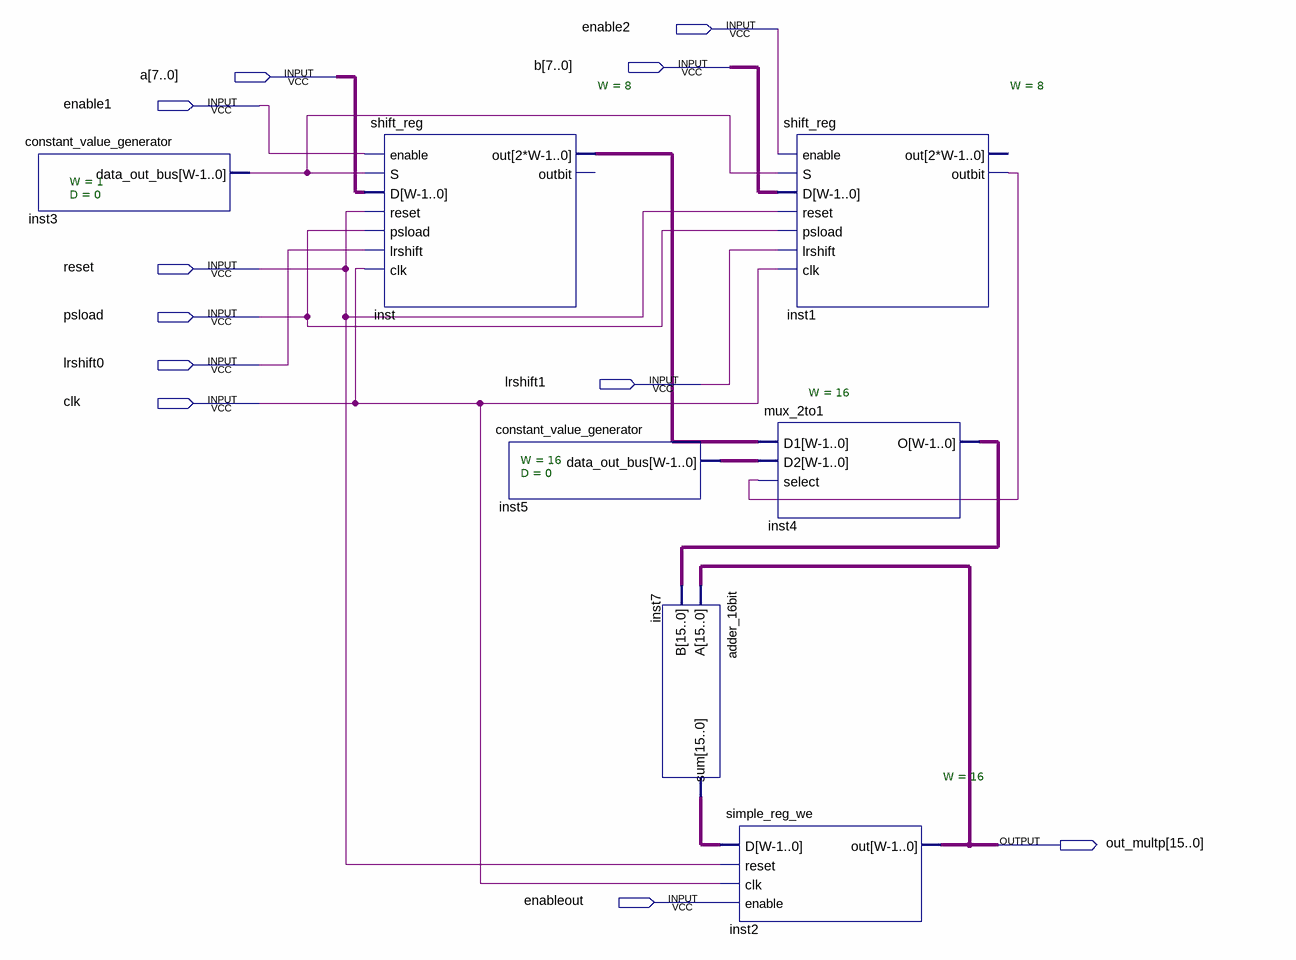
[diagram p0: schematic sheet]
// Quartus schematic schematic_multiplier.bdf as structural Verilog: 7 symbols, 11 pins
module schematic_multiplier (
  input  enable2,
  input  [7:0] b,
  input  [7:0] a,
  input  enable1,
  input  reset,
  input  psload,
  input  lrshift0,
  input  lrshift1,
  input  clk,
  input  enableout,
  output [15:0] out_multp
);

  wire inst1_outbit, inst3_data_out_bus;
  wire [15:0] inst4_o, inst5_data_out_bus, inst7_sum, inst_out;

  constant_value_generator #(.W(1), .D(0)) inst3 (.data_out_bus(inst3_data_out_bus));
  shift_reg #(.W(8)) inst (
    .enable(enable1), .S(inst3_data_out_bus), .D(a), .reset(reset), .psload(psload), .lrshift(lrshift0),
    .clk(clk), .out(inst_out));  // open: outbit
  constant_value_generator #(.W(16), .D(0)) inst5 (.data_out_bus(inst5_data_out_bus));
  adder_16bit inst7 (.A(out_multp), .B(inst4_o), .sum(inst7_sum));
  simple_reg_we #(.W(16)) inst2 (.D(inst7_sum), .reset(reset), .clk(clk), .enable(enableout), .out(out_multp));
  shift_reg #(.W(8)) inst1 (
    .enable(enable2), .S(inst3_data_out_bus), .D(b), .reset(reset), .psload(psload), .lrshift(lrshift1),
    .clk(clk), .outbit(inst1_outbit));  // open: out
  mux_2to1 #(.W(16)) inst4 (.D1(inst_out), .D2(inst5_data_out_bus), .select(inst1_outbit), .O(inst4_o));
endmodule
